# Altium schematic sheet ESP32_ExtendBoard.SchDoc
size A4; SheetNumber: 1; SheetTotal: 1
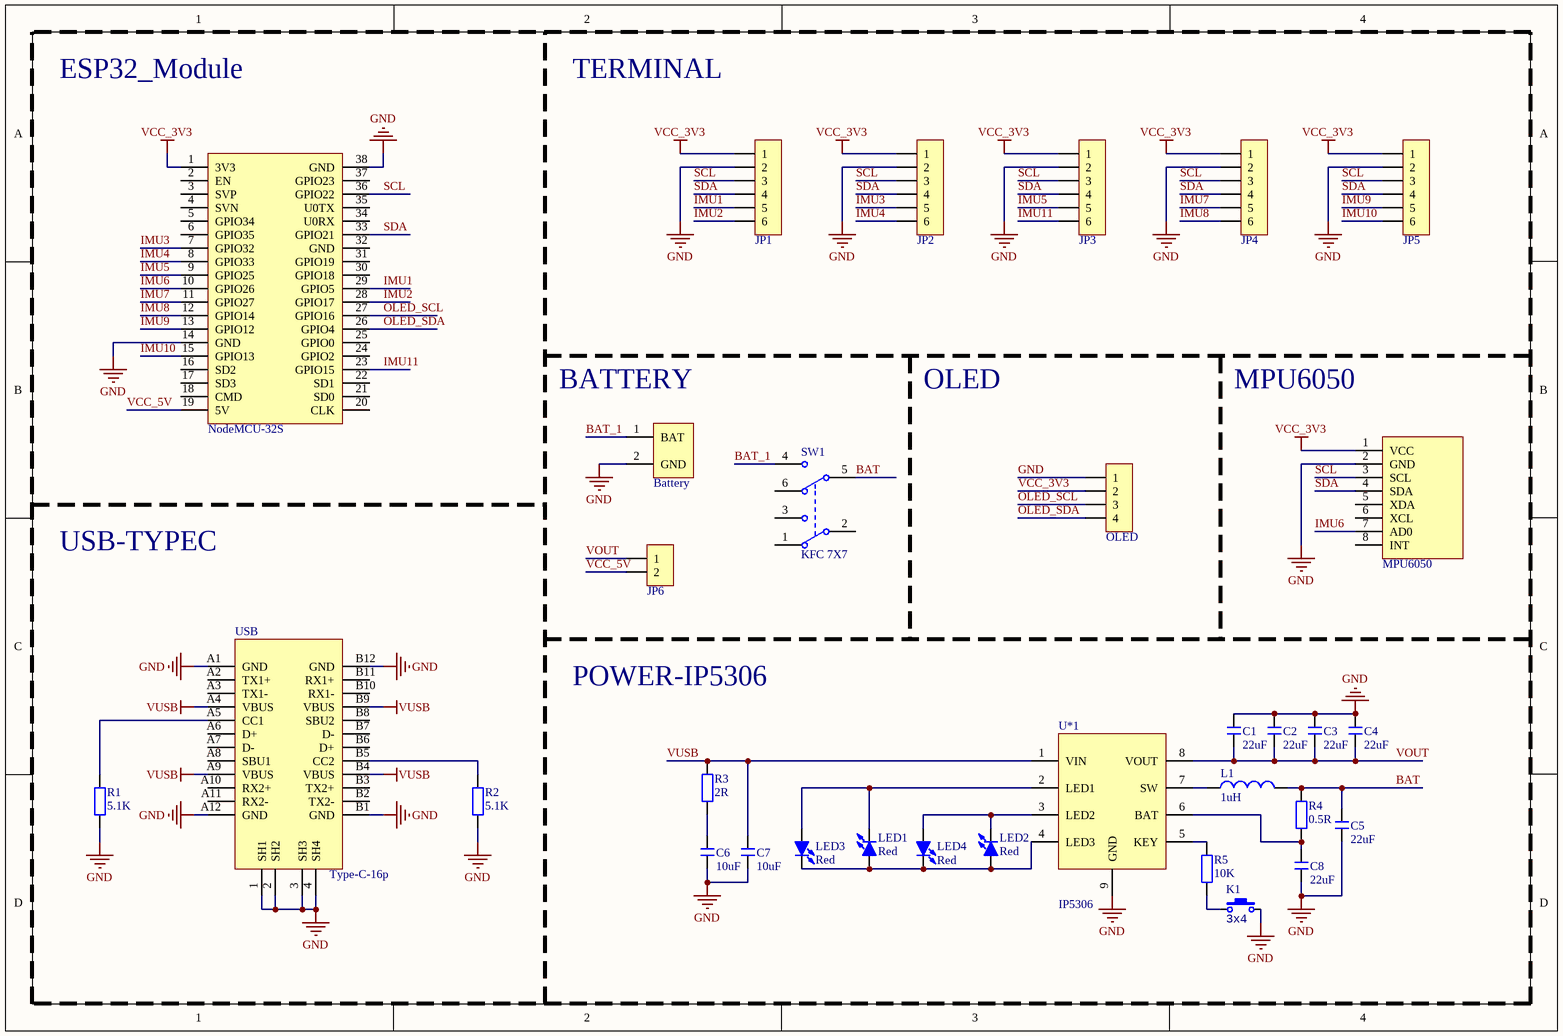
[diagram p0: ESP32_ExtendBoard.SchDoc]

## Parts
2  Battery  [Battery]
*  MPU6050  [PCBComponent_1]
?  NodeMCU-32S  [NodeMCU-32S]
C1  22uF  [C 0603_L]
C2  22uF  [C 0603_L]
C3  22uF  [C 0603_L]
C4  22uF  [C 0603_L]
C5  22uF  [C 0603_L]
C6  10uF  [C 0603_L]
C7  10uF  [C 0603_L]
C8  22uF  [C 0603_L]
JP1  HDR-1X6  [MX 1.25-WS-6P]  (value not drawn)
JP2  HDR-1X6  [MX 1.25-WS-6P]  (value not drawn)
JP3  HDR-1X6  [MX 1.25-WS-6P]  (value not drawn)
JP4  HDR-1X6  [MX 1.25-WS-6P]  (value not drawn)
JP5  HDR-1X6  [MX 1.25-WS-6P]  (value not drawn)
JP6  HDR-1X2  [HDR2.54-LI-2P]  (value not drawn)
K1  value 3x4  [ButtonTACT_3x4x2_180H]  (hidden comment: TACT 2P)
L1  1uH  [L 0805_L]
LED1  Red  [LED 0603W]
LED2  Red  [LED 0603W]
LED3  Red  [LED 0603W]
LED4  Red  [LED 0603W]
OLED  HDR-1X4  [HDR2.54-M-LI-4P]  (value not drawn)
R1  5.1K  [R 0603_L]
R2  5.1K  [R 0603_L]
R3  2R  [R 0603_L]
R4  0.5R  [R 0603_L]
R5  10K  [R 0603_L]
SW1  KFC 7X7  [KFC DIP-7X7]
U*1  IP5306  [ESOP8_N]
USB  Type-C-16p  [Type-C-TOP]

## Nets
GND: 2.2(GND) *.2(GND) ?.14(GND) ?.38(GND) C1.2 C2.2 C3.2 C4.2 C5.1 C6.1 C7.1 C8.1 JP1.2 JP2.2 JP3.2 JP4.2 JP5.2 K1.2 OLED.1 R1.1 R2.1 U*1.9(GND) USB.1(SH1) USB.2(SH2) USB.3(SH3) USB.4(SH4) USB.A1(GND) USB.A12(GND) USB.B1(GND) USB.B12(GND)
VCC_3V3: *.1(VCC) ?.1(3V3) JP1.1 JP2.1 JP3.1 JP4.1 JP5.1 OLED.2
VUSB: C7.2 R3.2 U*1.1(VIN) USB.A4(VBUS) USB.A9(VBUS) USB.B4(VBUS) USB.B9(VBUS)
BAT: C5.2 L1.2 R4.2 SW1.5(COM2)
BAT_1: 2.1(BAT) SW1.4(NO2)
IMU1: ?.29(GPIO5) JP1.5
IMU2: ?.28(GPIO17) JP1.6
IMU3: ?.7(GPIO32) JP2.5
IMU4: ?.8(GPIO33) JP2.6
IMU5: ?.9(GPIO25) JP3.5
IMU6: *.7(AD0) ?.10(GPIO26)
IMU7: ?.11(GPIO27) JP4.5
IMU8: ?.12(GPIO14) JP4.6
IMU9: ?.13(GPIO12) JP5.5
IMU10: ?.15(GPIO13) JP5.6
IMU11: ?.23(GPIO15) JP3.6
OLED_SCL: ?.27(GPIO16) OLED.3
OLED_SDA: ?.26(GPIO4) OLED.4
SCL: *.3(SCL) ?.36(GPIO22) JP1.3 JP2.3 JP3.3 JP4.3 JP5.3
SDA: *.4(SDA) ?.33(GPIO21) JP1.4 JP2.4 JP3.4 JP4.4 JP5.4
VCC_5V: ?.19(5V) JP6.2
VOUT: C1.1 C2.1 C3.1 C4.1 JP6.1 U*1.8(VOUT)
NetC6_2: C6.2 R3.1
NetC8_2: C8.2 R4.1 U*1.6(BAT)
NetK1_1: K1.1 R5.1
NetL1_1: L1.1 U*1.7(SW)
NetLED1_1: LED1.1(A) LED2.1(A) LED3.2(K) LED4.2(K) U*1.4(LED3)
NetLED1_2: LED1.2(K) LED3.1(A) U*1.2(LED1)
NetLED2_2: LED2.2(K) LED4.1(A) U*1.3(LED2)
NetR1_2: R1.2 USB.A5(CC1)
NetR2_2: R2.2 USB.B5(CC2)
NetR5_2: R5.2 U*1.5(KEY)

Not connected (* = marked no-connect by the designer): * 5(XDA) 6(XCL) 8(INT); ? 2(EN) 3(SVP) 4(SVN) 5(GPIO34) 6(GPIO35) 16(SD2) 17(SD3) 18(CMD) 20(CLK) 21(SD0) 22(SD1) 24(GPIO2) 25(GPIO0) 30(GPIO18) 31(GPIO19) 32(GND) 34(U0RX) 35(U0TX) 37(GPIO23); SW1 1(NC1) 2(COM2) 3(NO1) 6(NC2); USB A2(TX1+) A3(TX1-) A6(D+) A7(D-) A8(SBU1) A10(RX2+) A11(RX2-) B2(TX2-) B3(TX2+) B6(D+) B7(D-) B8(SBU2) B10(RX1-) B11(RX1+)

## Notes on the sheet
- ESP32_Module
- TERMINAL
- (near 2) BATTERY
- OLED
- MPU6050
- USB-TYPEC
- POWER-IP5306

## Library data of the parts
C1-C8 = C: 无极性贴片电容; 版权归属: 源创客; 材质: X7R; BOM名称: 无极性贴片电容; 学习资源: www.ooocke.com
JP1-JP5 = Header 6: 6P接插件; 版权归属: 源创客; BOM名称: 6P接插件; 学习资源: www.ooocke.com
JP6 = Header 2: 2P接插件; 版权归属: 源创客; BOM名称: 2P接插件; 学习资源: www.ooocke.com
K1 = ButtonTACT_3x4x2_180: Button; type: TACT 2P
L1 = L: 小功率贴片电感; 版权归属: 源创客; BOM名称: 小功率贴片电感; 学习资源: www.ooocke.com
LED1-LED4 = LED-SMD: 贴片LED; 版权归属: 源创客; BOM名称: 贴片LED; 学习资源: www.ooocke.com
OLED = Header 4: 4P接插件; 版权归属: 源创客; BOM名称: 4P接插件; 学习资源: www.ooocke.com
R1-R5 = R: 贴片电阻; 版权归属: 源创客; BOM名称: 贴片电阻; 学习资源: www.ooocke.com
SW1 = KFC 7X7: 7*7自锁开关; 版权归属: 源创客; BOM名称: 7*7自锁开关; 学习资源: www.ooocke.com